# EAGLE schematic 8266_relay (EAGLE 6.6.0)
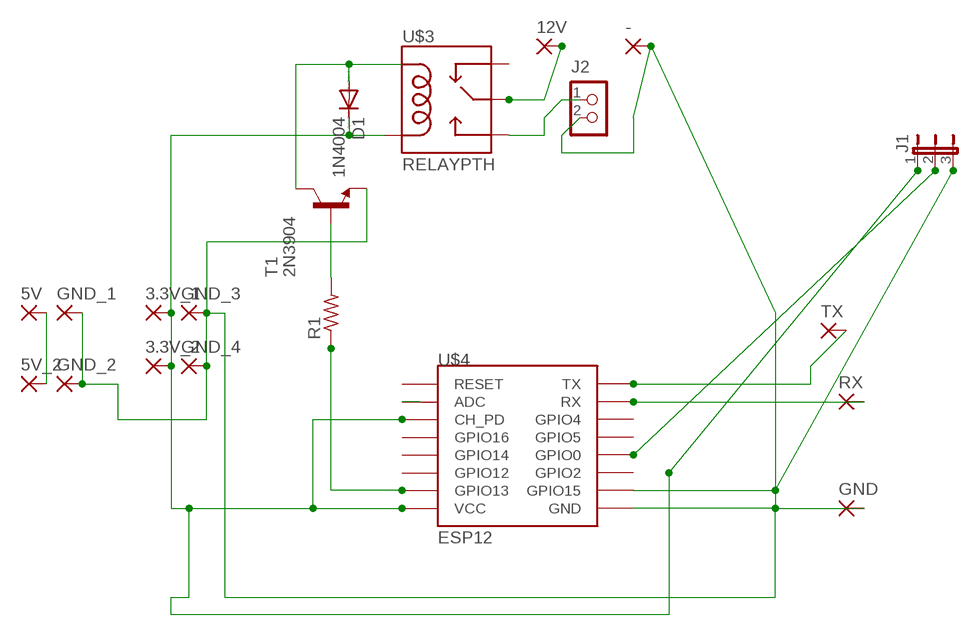
[diagram p0: schematic, sheet 1]

## Parts
3.3V_1  2,15/1,0  [2,15/1,0]
3.3V_2  2,15/1,0  [2,15/1,0]
5V  2,15/1,0  [2,15/1,0]
5V_2  2,15/1,0  [2,15/1,0]
12V  2,15/1,0  [2,15/1,0]
-  2,15/1,0  [2,15/1,0]
D1  1N4004  [DO41-10]
GND  2,15/1,0  [2,15/1,0]
GND_1  2,15/1,0  [2,15/1,0]
GND_2  2,15/1,0  [2,15/1,0]
GND_3  2,15/1,0  [2,15/1,0]
GND_4  2,15/1,0  [2,15/1,0]
J1  JP2E  [JP2]
J2  CON_TERMINAL_BLOCK_02-5MM  [TERMINAL_BLOCK_2P_5]
R1  R-US_0309/10  [0309/10]
RX  2,15/1,0  [2,15/1,0]
T1  2N3904  [TO92]
TX  2,15/1,0  [2,15/1,0]
U$3  RELAYPTH  [SRD-05VDC-SL-C]
U$4  ESP12  [ESP12]

## Nets
5V: 5V.1(P) 5V_2.1(P)
12V: 12V.1(P) U$3.SWCOMMON
GND: -.1(P) GND.1(P) GND_1.1(P) GND_2.1(P) GND_3.1(P) GND_4.1(P) J1.3 J2.2 T1.3(E) U$4.GND U$4.GPIO15
N$1: J1.2 U$4.GPIO0
N$2: U$4.ADC
N$3: R1.1 U$4.GPIO13
N$4: J2.1 U$3.SWOPEN
N$5: 3.3V_1.1(P) 3.3V_2.1(P) D1.C J1.1 U$3.COIL0 U$4.CH_PD U$4.VCC
N$6: D1.A T1.1(C) U$3.COIL1
N$7: R1.2 T1.2(B)
RX: RX.1(P) U$4.RX
TX: TX.1(P) U$4.TX
Unconnected: U$3.SWCLOSED(SWCLOSE) U$4.GPIO2 U$4.GPIO4 U$4.GPIO5 U$4.GPIO12 U$4.GPIO14 U$4.GPIO16 U$4.RESET

## Library data of the parts
3.3V_1 3.3V_2 5V 5V_2 12V - GND GND_1-GND_4 RX TX = wirepad:2,15/1,0: THROUGH-HOLE PAD
D1 = diode:1N4004: DIODE general purpose rectifier, 1 A
J1 = jumper:JP2E: JUMPER
J2 = dp_devices:CON_TERMINAL_BLOCK_02: 2 poles wire to board terminal block
R1 = resistor:R-US_: RESISTOR, American symbol
T1 = transistor-neu-to92:2N3904: NPN TRANSISTOR
U$3 = SRD-05VDC-SL-C:RELAY: SPDT relay (COM-00101)
U$4 = esp8266modules:ESP12: ESP8266 Wifi module 12